# Altium schematic sheet Cell_Connections.SchDoc: =SheetTitle
size A4; SheetTitle: Cell Connections; DrawnBy: Samyar Sadat Akhavi
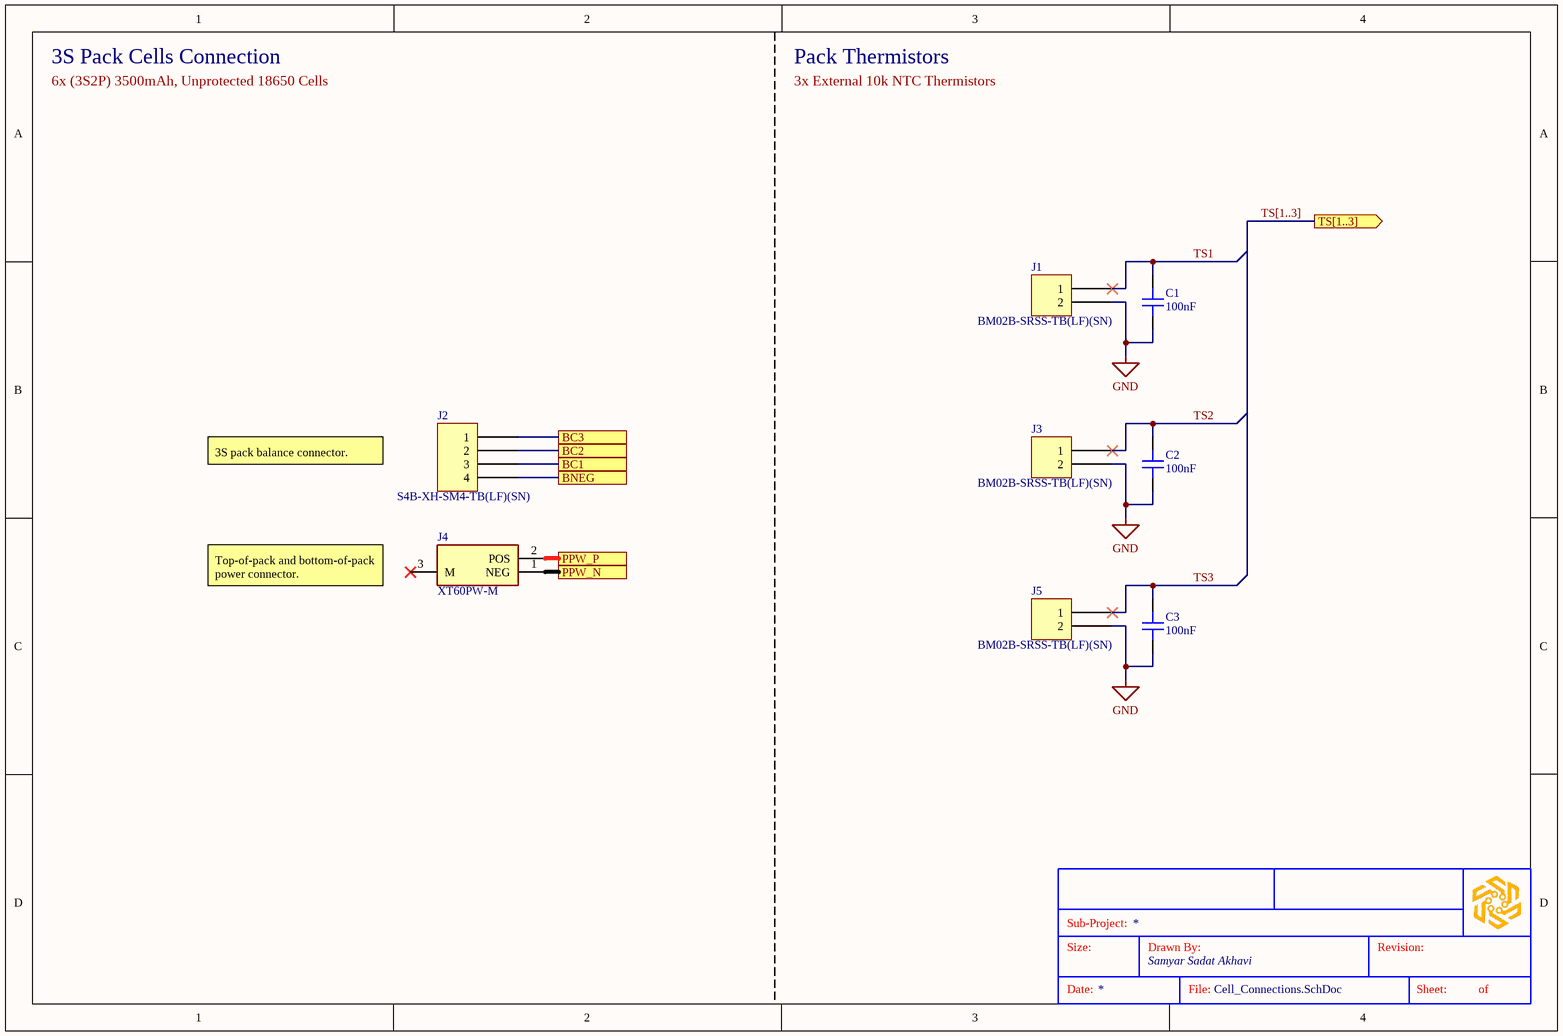
[diagram p0: Cell_Connections.SchDoc]

## Parts
?  (no value)  (graphical)
C1  100nF  [CAP 0603_1608]
C2  100nF  [CAP 0603_1608]
C3  100nF  [CAP 0603_1608]
J1  BM02B-SRSS-TB(LF)(SN)  [JST BM02B-SRSS-TB]
J2  S4B-XH-SM4-TB(LF)(SN)  [JST XH S4B-XH-SM4-TB]
J3  BM02B-SRSS-TB(LF)(SN)  [JST BM02B-SRSS-TB]
J4  XT60PW-M  [XT60PWM]
J5  BM02B-SRSS-TB(LF)(SN)  [JST BM02B-SRSS-TB]

## Ports
BC1 (see Pack_BMS_Module[2B], Battery_Management[1C], Secondary_Protector[2C]), BC2 (see Pack_BMS_Module[2B], Battery_Management[1C], Secondary_Protector[2B]), BC3 (see Pack_BMS_Module[2B], Battery_Management[1C], Secondary_Protector[2B]), BNEG (see Pack_BMS_Module[2B], Battery_Management[1C]), PPW_N (see Pack_BMS_Module[2B], Battery_Management[1C]), PPW_P (see Pack_BMS_Module[2B], Battery_Management[1C]), TS[1..3] (out, see Pack_BMS_Module[2B], Battery_Management[4C])

## Nets
GND: C1.1 C2.1 C3.1 J1.2 J3.2 J5.2
BC1: J2.3 ; port BC1
BC2: J2.2 ; port BC2
BC3: J2.1 ; port BC3
BNEG: J2.4 ; port BNEG
PPW_N: J4.1(NEG) ; port PPW_N
PPW_P: J4.2(POS) ; port PPW_P
TS1: C1.2 J1.1
TS2: C2.2 J3.1
TS3: C3.2 J5.1

Not connected (* = marked no-connect by the designer): J4 3(M)*

## Buses and harness runs
bus TS[1..3] = port TS[1..3]

## Notes on the sheet
- 3S Pack Cells Connection
- 6x (3S2P) 3500mAh, Unprotected 18650 Cells
- Pack Thermistors
- 3x External 10k NTC Thermistors
- 3S pack balance connector.
- Top-of-pack and bottom-of-pack power connector.
- Sub-Project:
- Size:
- Drawn By:
- Revision:
- Date:
- File:
- Sheet:
- of

## Library data of the parts
? = SGR-STDTBSA4: STANDARD SCHEMATICS TITLE BLOCK
C1-C3 = GEN-CC100NT10V25KX7R603: GENERIC 0603 MLC CAPACITOR; Tolerance: ±10%; Voltage: 25V; Dielectric: X7R; Part Number: GEN-CC100NT10V25KX7R603; Value: 100nF
J1 J3 J5 = BM02B-SRSS-TB(LF)(SN): CONN HEADER SMD 2POS 1MM; Manufacturer: JST Sales America Inc.; Current Rating (Amps): 0.7A; Material Flammability Rating: UL94 V-0; Number of Positions: 2; Number of Positions Loaded: All; Pitch - Mating: 0.039" (1.00mm); Shrouding: Shrouded - 4 Wall; Style: Board to Cable/Wire; Voltage Rating: 50V; Part Number: BM02B-SRSS-TB(LF)(SN); ComponentLink1Description: Datasheet; ComponentLink1URL: http://www.jst-mfg.com/product/pdf/eng/eSR.pdf; ComponentLink2Description: DigiKey Link; ComponentLink2URL: http://digikey.com/product-detail/en/jst-sales-america-inc/BM02B-SRSS-TB-LF-SN/455-1788-1-ND/926859; Connector Type: Header; Contact Finish - Mating: Tin; Contact Finish - Post: Tin; Contact Material: Copper Alloy; Contact Shape: Square; Contact Type: Male Pin; Fastening Type: Push-Pull; Features: Solder Retention; Insulation Color: Natural; Insulation Height: 0.167" (4.25mm); Insulation Material: Polyamide (PA), Nylon; LastUpdated: 1/12/2020 10:11:04 PM; Lifecycle Status: Active; Minimum Order: 1; Mounting Type: Surface Mount; Number of Rows: 1; Operating Temperature: -25°C ~ 85°C; Packaging: TapeAndReel; PartId: 12; Part Status: Active; Price: 0.22; Series: SR; Supplier 1: DigiKey; Supplier Part Number 1: 455-1788-1-ND; Termination: Solder
J2 = S4B-XH-SM4-TB(LF)(SN): CONN HEADER SMD R/A 4POS 2.5MM; Manufacturer: JST Sales America Inc.; Current Rating (Amps): 3A; Material Flammability Rating: UL94 V-0; Number of Positions: 4; Number of Positions Loaded: All; Pitch - Mating: 0.098" (2.50mm); Row Spacing - Mating: -25°C ~ 85°C; Shrouding: Shrouded - 4 Wall; Style: Board to Cable/Wire; Part Number: S4B-XH-SM4-TB(LF)(SN); ComponentLink1Description: Datasheet; ComponentLink1URL: http://www.jst-mfg.com/product/pdf/eng/eXH.pdf; ComponentLink2Description: DigiKey Link; ComponentLink2URL: http://digikey.com/product-detail/en/jst-sales-america-inc/S4B-XH-SM4-TB-LF-SN/455-2262-1-ND/1651060; Connector Type: Header; Contact Finish - Mating: Tin; Contact Finish - Post: Tin; Contact Material: Copper Alloy; Contact Shape: Square; Contact Type: Male Pin; Fastening Type: Detent Lock; Features: Solder Retention; Insulation Color: Natural; Insulation Height: 0.236" (6.00mm); Insulation Material: Polyamide (PA6T), Nylon 6T; LastUpdated: 8/29/2025 7:06:32 AM; Lifecycle Status: Active; Minimum Order: 1; Mounting Type: Surface Mount, Right Angle; Number of Rows: 1; Operating Temperature: -25°C ~ 85°C; Packaging: TapeAndReel; PartId: 191; Part Status: Active; Price: 0.49; Series: XH; Supplier 1: DigiKey; Supplier Part Number 1: 455-2262-1-ND; Termination: Solder
J4 = XT60PW-M: MALE XT60 PCB-MOUNT SOLDERABLE CONNECTOR; Manufacturer: AMASS; Part Number: XT60PW-M; Supplier 1: TME; Supplier Part Number 1: XT60PW-M